# Altium schematic sheet 04_LEDs.SchDoc: ECE315 Analog
size A; Date: 4/25/2017; ApprovedBy: JSK; CheckedBy: JSK; Author: JSK; CompanyName: University of Wisconsin; DrawnBy: JSK; Engineer: JSK; Organization: ECE 315; Address1: College of Engineering; Address2: 1415 Engineering Drive; Address3: Madison, WI 53706; Address4: ECE 315 Fall 2017; Revision: A; SheetNumber: 2; SheetTotal: 2; AssemblyNumber: 0; MachineName: ECE315-S19; PCBNumber: 001; ApprovedDate: 1/17/2019
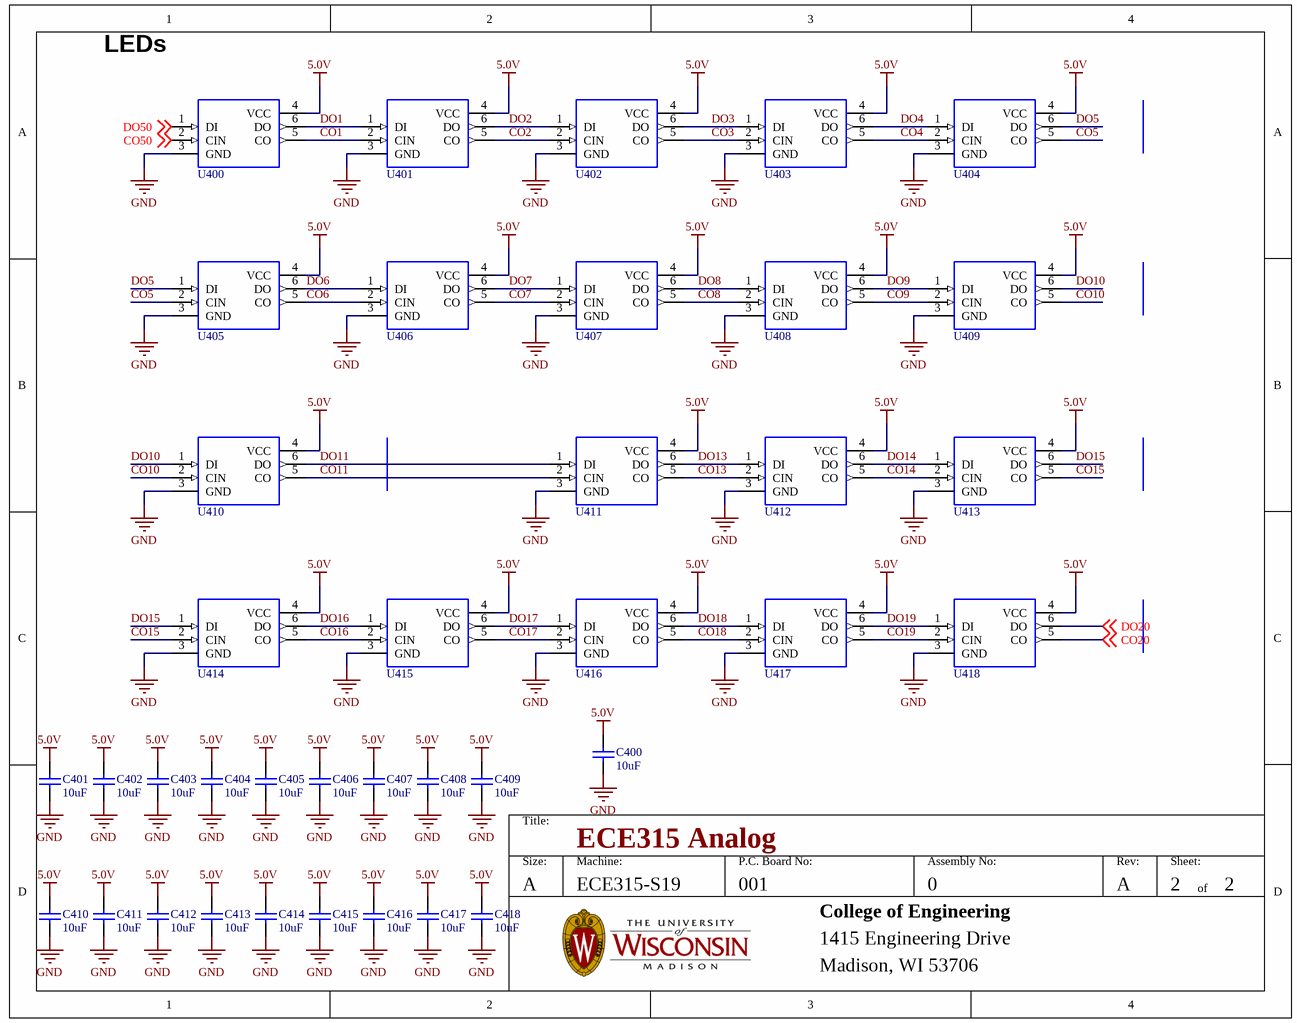
[diagram p0: 04_LEDs.SchDoc]

## Parts
C400  10uF  [CAP_0805]
C401  10uF  [CAP_0805]
C402  10uF  [CAP_0805]
C403  10uF  [CAP_0805]
C404  10uF  [CAP_0805]
C405  10uF  [CAP_0805]
C406  10uF  [CAP_0805]
C407  10uF  [CAP_0805]
C408  10uF  [CAP_0805]
C409  10uF  [CAP_0805]
C410  10uF  [CAP_0805]
C411  10uF  [CAP_0805]
C412  10uF  [CAP_0805]
C413  10uF  [CAP_0805]
C414  10uF  [CAP_0805]
C415  10uF  [CAP_0805]
C416  10uF  [CAP_0805]
C417  10uF  [CAP_0805]
C418  10uF  [CAP_0805]
U400  IC_APA102C  [APA102C]  (value not drawn)
U401  IC_APA102C  [APA102C]  (value not drawn)
U402  IC_APA102C  [APA102C]  (value not drawn)
U403  IC_APA102C  [APA102C]  (value not drawn)
U404  IC_APA102C  [APA102C]  (value not drawn)
U405  IC_APA102C  [APA102C]  (value not drawn)
U406  IC_APA102C  [APA102C]  (value not drawn)
U407  IC_APA102C  [APA102C]  (value not drawn)
U408  IC_APA102C  [APA102C]  (value not drawn)
U409  IC_APA102C  [APA102C]  (value not drawn)
U410  IC_APA102C  [APA102C]  (value not drawn)
U411  IC_APA102C  [APA102C]  (value not drawn)
U412  IC_APA102C  [APA102C]  (value not drawn)
U413  IC_APA102C  [APA102C]  (value not drawn)
U414  IC_APA102C  [APA102C]  (value not drawn)
U415  IC_APA102C  [APA102C]  (value not drawn)
U416  IC_APA102C  [APA102C]  (value not drawn)
U417  IC_APA102C  [APA102C]  (value not drawn)
U418  IC_APA102C  [APA102C]  (value not drawn)

## Nets
5.0V: C400.2 C401.2 C402.2 C403.2 C404.2 C405.2 C406.2 C407.2 C408.2 C409.2 C410.2 C411.2 C412.2 C413.2 C414.2 C415.2 C416.2 C417.2 C418.2 U400.4(VCC) U401.4(VCC) U402.4(VCC) U403.4(VCC) U404.4(VCC) U405.4(VCC) U406.4(VCC) U407.4(VCC) U408.4(VCC) U409.4(VCC) U410.4(VCC) U411.4(VCC) U412.4(VCC) U413.4(VCC) U414.4(VCC) U415.4(VCC) U416.4(VCC) U417.4(VCC) U418.4(VCC)
GND: C400.1 C401.1 C402.1 C403.1 C404.1 C405.1 C406.1 C407.1 C408.1 C409.1 C410.1 C411.1 C412.1 C413.1 C414.1 C415.1 C416.1 C417.1 C418.1 U400.3(GND) U401.3(GND) U402.3(GND) U403.3(GND) U404.3(GND) U405.3(GND) U406.3(GND) U407.3(GND) U408.3(GND) U409.3(GND) U410.3(GND) U411.3(GND) U412.3(GND) U413.3(GND) U414.3(GND) U415.3(GND) U416.3(GND) U417.3(GND) U418.3(GND)
CO1: U400.5(CO) U401.2(CIN)
CO2: U401.5(CO) U402.2(CIN)
CO3: U402.5(CO) U403.2(CIN)
CO4: U403.5(CO) U404.2(CIN)
CO5: U404.5(CO) U405.2(CIN)
CO6: U405.5(CO) U406.2(CIN)
CO7: U406.5(CO) U407.2(CIN)
CO8: U407.5(CO) U408.2(CIN)
CO9: U408.5(CO) U409.2(CIN)
CO10: U409.5(CO) U410.2(CIN)
CO11: U410.5(CO) U411.2(CIN)
CO13: U411.5(CO) U412.2(CIN)
CO14: U412.5(CO) U413.2(CIN)
CO15: U413.5(CO) U414.2(CIN)
CO16: U414.5(CO) U415.2(CIN)
CO17: U415.5(CO) U416.2(CIN)
CO18: U416.5(CO) U417.2(CIN)
CO19: U417.5(CO) U418.2(CIN)
CO20: U418.5(CO) ; off-sheet CO20
CO50: U400.2(CIN) ; off-sheet CO50
DO1: U400.6(DO) U401.1(DI)
DO2: U401.6(DO) U402.1(DI)
DO3: U402.6(DO) U403.1(DI)
DO4: U403.6(DO) U404.1(DI)
DO5: U404.6(DO) U405.1(DI)
DO6: U405.6(DO) U406.1(DI)
DO7: U406.6(DO) U407.1(DI)
DO8: U407.6(DO) U408.1(DI)
DO9: U408.6(DO) U409.1(DI)
DO10: U409.6(DO) U410.1(DI)
DO11: U410.6(DO) U411.1(DI)
DO13: U411.6(DO) U412.1(DI)
DO14: U412.6(DO) U413.1(DI)
DO15: U413.6(DO) U414.1(DI)
DO16: U414.6(DO) U415.1(DI)
DO17: U415.6(DO) U416.1(DI)
DO18: U416.6(DO) U417.1(DI)
DO19: U417.6(DO) U418.1(DI)
DO20: U418.6(DO) ; off-sheet DO20
DO50: U400.1(DI) ; off-sheet DO50

## Notes on the sheet
- LEDs
- Title:
- Size:
- A
- Machine:
- P.C. Board No:
- Assembly No:
- Rev:
- Sheet:
- of
- College of Engineering
- 1415 Engineering Drive
- Madison, WI 53706

## Library data of the parts
C400-C418 = CAP_0805_U_010.00: CAP CER 10UF 16V X7R 0805; Manufacturer: Samsung; Manufacturer Part Number: CL21A106KPCLQNC; Tolerance: 10%; Voltage Rating: 10V; Dielectric: X5R; ComponentLink3URL: https://datasheet.ciiva.com/26920/getdatasheetpartid-355170-26920201.pdf; ComponentLink3Description: https://datasheet.ciiva.com/26920/getdatasheetpartid-355170-26920201.pdf; Supplier 1: Digi-Key; Stock 1: 40000; Pricing 1: 1=0.22, 10=0.148, 100=0.0749, 500=0.05122, 1000=0.04531 (USD); Mount: Surface Mount; Case/Package: 0805; Case Code (Metric): 2012; Case Code (Imperial): 0805; Contact Plating: Tin; Min Operating Temperature: -55°C; Max Operating Temperature: 85°C; Packaging: Tape and Reel; Package Quantity: 1; Length: 2mm; Height: 0.85mm; Width: 0.049inch; Thickness: 0.037inch; Depth: 1.25mm; Radiation Hardening: No; ComponentLink1URL: https://datasheet.ciiva.com/25730/cl21a106kpclqnc-25730594.pdf; ComponentLink1Description: https://datasheet.ciiva.com/25730/cl21a106kpclqnc-25730594.pdf; Supplier Part Number 1: 1276-2402-1-ND; Capacitance: 10uF
U400-U418 = IC_APA102C: APA102C LED